# EAGLE schematic FlightComputer_PowerDistributionBoard_Rev_A (EAGLE 9.0.1)
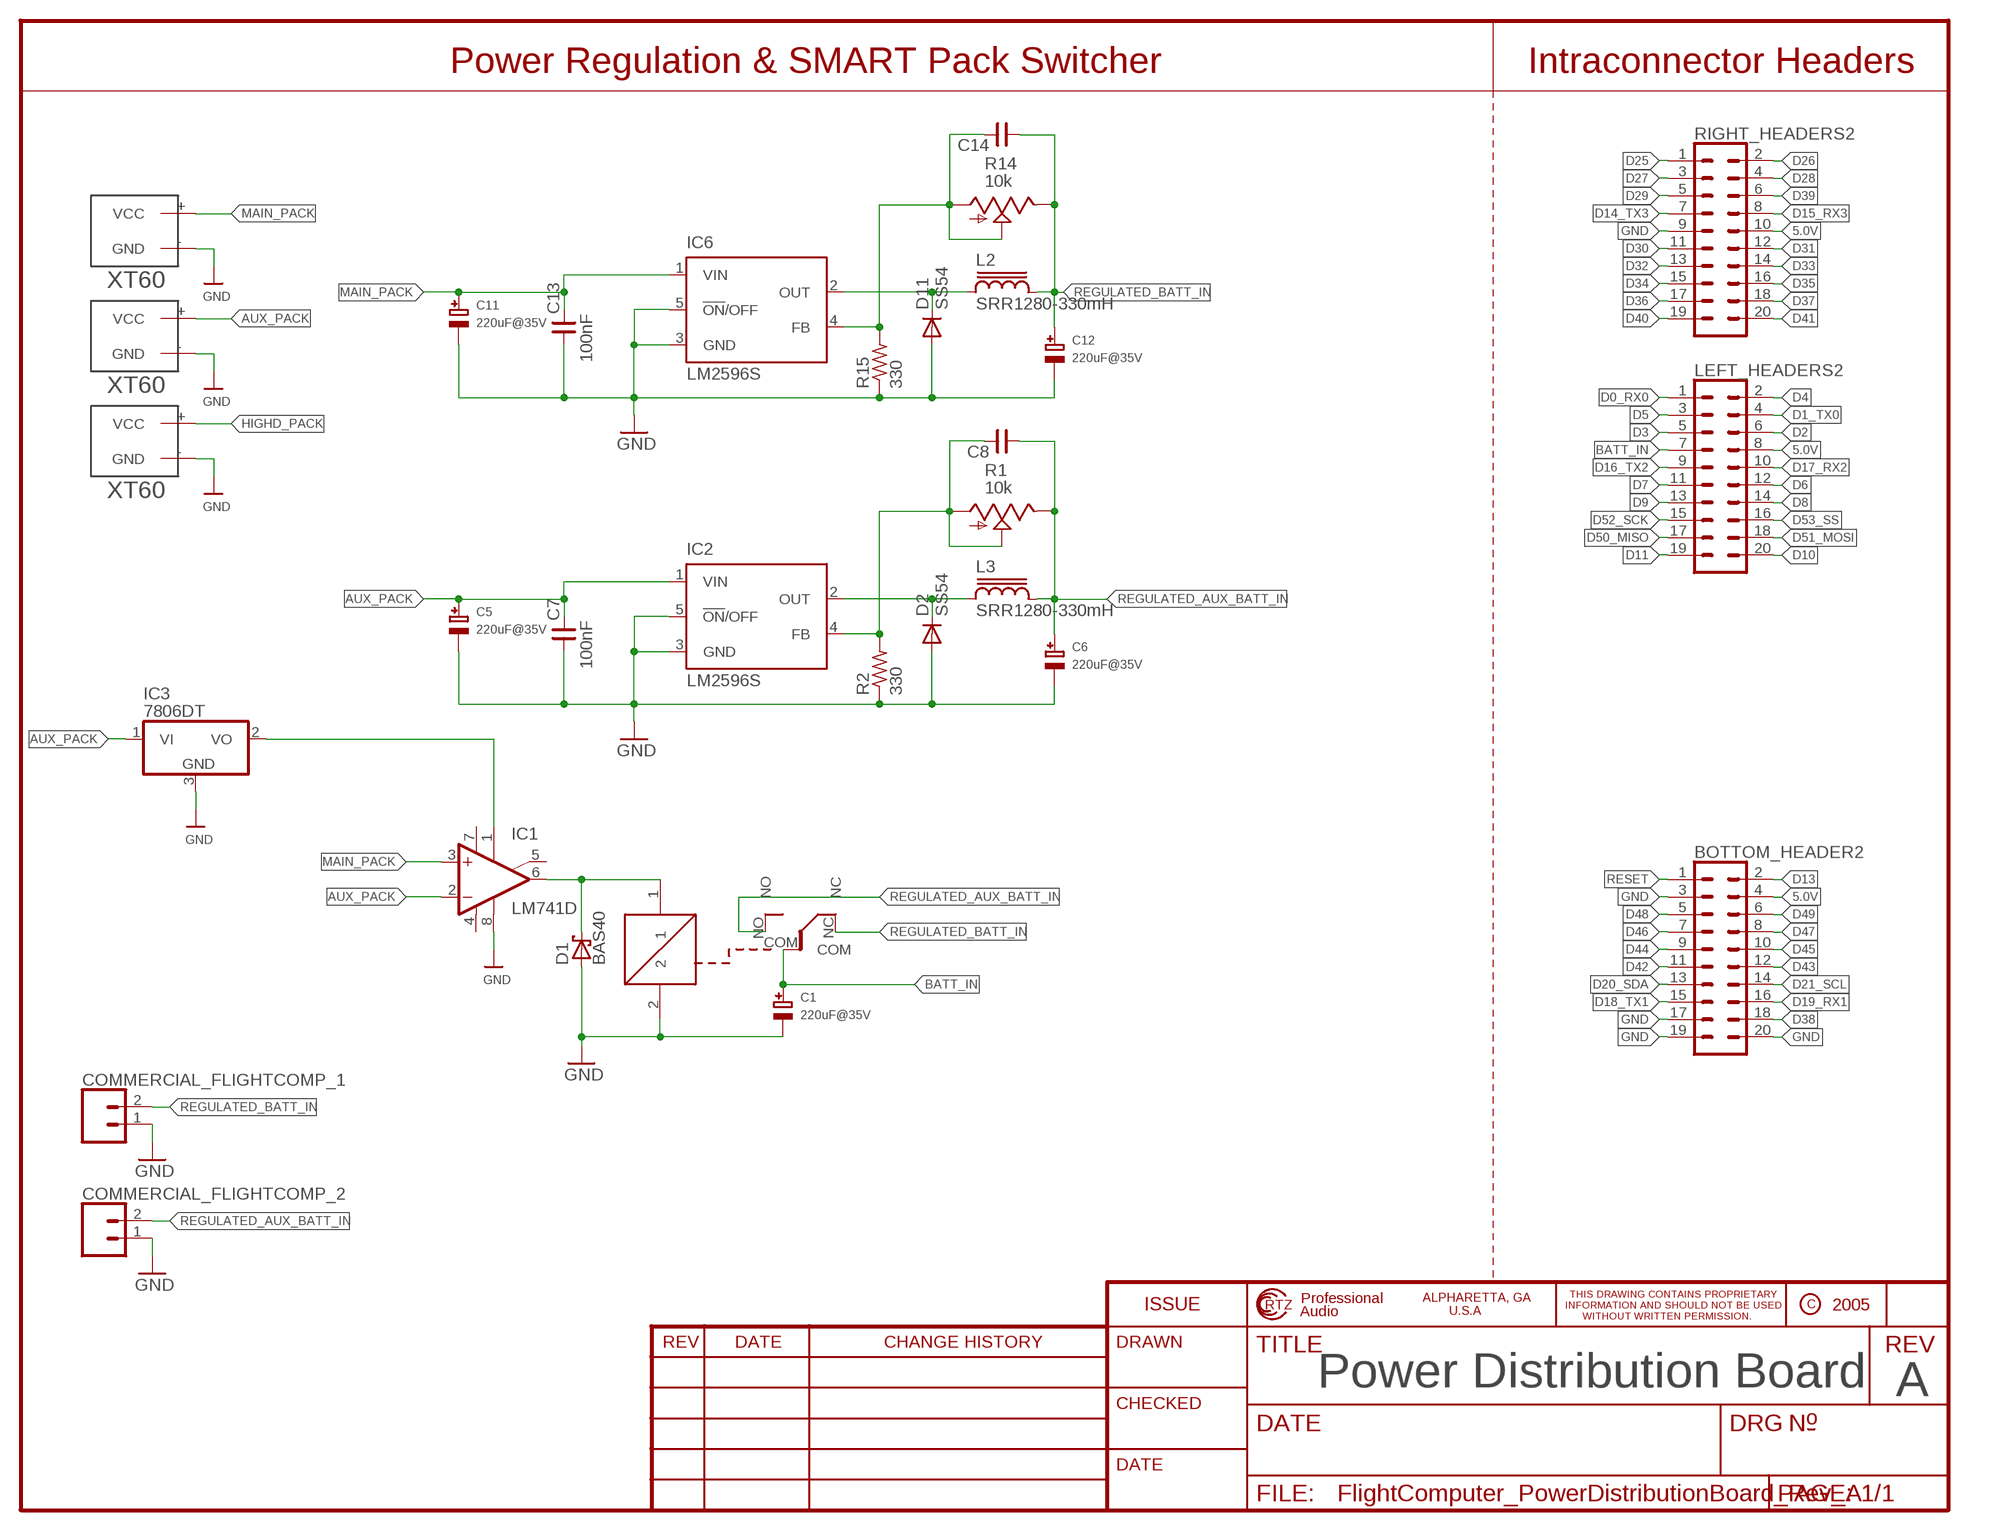
[diagram p0: schematic, sheet 1]

## Parts
BOTTOM_HEADER2  CONN_10X2  [2X10]
C1  220uF@35V  CAP_ELECTROLYTICPANASONIC_D  [PANASONIC_D]
C5  220uF@35V  CAP_ELECTROLYTICPANASONIC_D  [PANASONIC_D]
C6  220uF@35V  CAP_ELECTROLYTICPANASONIC_D  [PANASONIC_D]
C7  100nF  CNP-0603  [0603]
C8  CNP-0603  [0603]
C11  220uF@35V  CAP_ELECTROLYTICPANASONIC_D  [PANASONIC_D]
C12  220uF@35V  CAP_ELECTROLYTICPANASONIC_D  [PANASONIC_D]
C13  100nF  CNP-0603  [0603]
C14  CNP-0603  [0603]
COMMERCIAL_FLIGHTCOMP_1  CONN_02  [1X02]
COMMERCIAL_FLIGHTCOMP_2  CONN_02  [1X02]
D1  BAS40  [SOT23]
D2  SS54  S3G  [DO214AB]
D11  SS54  S3G  [DO214AB]
IC1  LM741D  [SO08]
IC2  LM2596S  [TO263-5]
IC3  7806DT  [TO252]
IC6  LM2596S  [TO263-5]
L2  SRR1280-330mH  SRR1280  [SRR1280]
L3  SRR1280-330mH  SRR1280  [SRR1280]
LEFT_HEADERS2  CONN_10X2  [2X10]
R1  10k  TRIM_US-S64W  [S64W]
R2  330  R-US_R0603  [R0603]
R14  10k  TRIM_US-S64W  [S64W]
R15  330  R-US_R0603  [R0603]
RIGHT_HEADERS2  CONN_10X2  [2X10]
U$2  XT60  [XT60]
U$3  XT60  [XT60]
U$4  XT60  [XT60]
U$14  RW-SH  [RW-SH]

## Nets
5.0V: BOTTOM_HEADER2.4 LEFT_HEADERS2.8 RIGHT_HEADERS2.10
AUX_PACK: C5.+ C7.2 IC1.2(-IN) IC2.1(VIN) IC3.1(VI) U$3.+(VCC)
BATT_IN: C1.+ LEFT_HEADERS2.7 U$14.COM
D0_RX0: LEFT_HEADERS2.1
D1_TX0: LEFT_HEADERS2.4
D2: LEFT_HEADERS2.6
D3: LEFT_HEADERS2.5
D4: LEFT_HEADERS2.2
D5: LEFT_HEADERS2.3
D6: LEFT_HEADERS2.12
D7: LEFT_HEADERS2.11
D8: LEFT_HEADERS2.14
D9: LEFT_HEADERS2.13
D10: LEFT_HEADERS2.20
D11: LEFT_HEADERS2.19
D13: BOTTOM_HEADER2.2
D14_TX3: RIGHT_HEADERS2.7
D15_RX3: RIGHT_HEADERS2.8
D16_TX2: LEFT_HEADERS2.9
D17_RX2: LEFT_HEADERS2.10
D18_TX1: BOTTOM_HEADER2.15
D19_RX1: BOTTOM_HEADER2.16
D20_SDA: BOTTOM_HEADER2.13
D21_SCL: BOTTOM_HEADER2.14
D25: RIGHT_HEADERS2.1
D26: RIGHT_HEADERS2.2
D27: RIGHT_HEADERS2.3
D28: RIGHT_HEADERS2.4
D29: RIGHT_HEADERS2.5
D30: RIGHT_HEADERS2.11
D31: RIGHT_HEADERS2.12
D32: RIGHT_HEADERS2.13
D33: RIGHT_HEADERS2.14
D34: RIGHT_HEADERS2.15
D35: RIGHT_HEADERS2.16
D36: RIGHT_HEADERS2.17
D37: RIGHT_HEADERS2.18
D38: BOTTOM_HEADER2.18
D39: RIGHT_HEADERS2.6
D40: RIGHT_HEADERS2.19
D41: RIGHT_HEADERS2.20
D42: BOTTOM_HEADER2.11
D43: BOTTOM_HEADER2.12
D44: BOTTOM_HEADER2.9
D45: BOTTOM_HEADER2.10
D46: BOTTOM_HEADER2.7
D47: BOTTOM_HEADER2.8
D48: BOTTOM_HEADER2.5
D49: BOTTOM_HEADER2.6
D50_MISO: LEFT_HEADERS2.17
D51_MOSI: LEFT_HEADERS2.18
D52_SCK: LEFT_HEADERS2.15
D53_SS: LEFT_HEADERS2.16
GND: BOTTOM_HEADER2.3 BOTTOM_HEADER2.17 BOTTOM_HEADER2.19 BOTTOM_HEADER2.20 C1.- C5.- C6.- C7.1 C11.- C12.- C13.1 COMMERCIAL_FLIGHTCOMP_1.1 COMMERCIAL_FLIGHTCOMP_2.1 D1.1(A) D2.A D11.A IC1.8(OPT) IC2.3(GND) IC2.5(!ON!/OFF) IC3.3(GND) IC6.3(GND) IC6.5(!ON!/OFF) R2.1 R15.1 RIGHT_HEADERS2.9 U$2.-(GND) U$3.-(GND) U$4.-(GND) U$14.2
HIGHD_PACK: U$4.+(VCC)
MAIN_PACK: C11.+ C13.2 IC1.3(+IN) IC6.1(VIN) U$2.+(VCC)
N$1: D2.C IC2.2(OUT) L3.1
N$2: C8.2 IC2.4(FB) R1.A R1.S R2.2
N$3: IC1.1(ON1) IC3.2(VO)
N$4: D1.3(C) IC1.6(OUT) U$14.1
N$30: D11.C IC6.2(OUT) L2.1
N$31: C14.2 IC6.4(FB) R14.A R14.S R15.2
REGULATED_AUX_BATT_IN: C6.+ C8.1 COMMERCIAL_FLIGHTCOMP_2.2 L3.2 R1.E U$14.NO
REGULATED_BATT_IN: C12.+ C14.1 COMMERCIAL_FLIGHTCOMP_1.2 L2.2 R14.E U$14.NC
RESET: BOTTOM_HEADER2.1
Unconnected: IC1.5(ON2)

## Notes on the sheet
- Power Regulation & SMART Pack Switcher | Intraconnector Headers
- Power Distribution Board | A

## Power pins joined to a net without a drawn wire
V+: IC1.7(V+)
V-: IC1.4(V-)

## Library data of the parts
BOTTOM_HEADER2 LEFT_HEADERS2 RIGHT_HEADERS2 = SparkFun-Connectors:CONN_10X2: Multi connection point. Often used as Generic Header-pin footprint for 0.1 inch spaced/style header connections On any of the 0.1 inch spaced packages, you can populate with these: Break Away Headers - Straight <https://www.sparkfun.com/products/116> (PRT-00116) Break Away Male Headers - Right Angle <https://www.sparkfun.com/products/553> (PRT-00553) Female Headers <https://www.sparkfun.com/products/115> (PRT-00115) Break Away Headers - Machine Pin <https://www.sparkfun.com/products/117> (PRT-00117) Break Away Female Headers - Swiss Machine Pin <https://www.sparkfun.com/products/743> (PRT-00743) Special note about the "SPECIAL" package: This was SPECIALLY designed to be used with our Graphic LCD Backpack. Be sure you want to use this! It is not only staggered on each line of header holes, but IT IS ALSO offset of the center point of the top and bottom lines by 5 mil. This causes the headers to lock into place on the "standard" footprint on the LCD screen. The extra squares on the tdocu layer are there simply to reference other pins (if you were to actually populate a longer header than ten long - this is what we do with the backpacks).
C1 C5 C6 C11 C12 = microbuilder:CAP_ELECTROLYTIC: Electrolytic Capacitors PANASONIC_C - Size C Panasonic Electrolytic Aluminum Capacitor 47µF 16V 20% Electrolytic Capacitor [Digikey: PCE3890TR-ND] PANASONIC_D - Size D Panasonic Electrolytic Aluminum Capacitor 100µF 25V 20% Electrolytic Capacitor [Digikey: PCE3898TR-ND]
C7 C8 C13 C14 = cap-master:CNP-: NON-POLARIZED CAP
COMMERCIAL_FLIGHTCOMP_1 COMMERCIAL_FLIGHTCOMP_2 = SparkFun-Connectors:CONN_02: Multi connection point. Often used as Generic Header-pin footprint for 0.1 inch spaced/style header connections On any of the 0.1 inch spaced packages, you can populate with these: Break Away Headers - Straight <https://www.sparkfun.com/products/116> (PRT-00116) Break Away Male Headers - Right Angle <https://www.sparkfun.com/products/553> (PRT-00553) Female Headers <https://www.sparkfun.com/products/115> (PRT-00115) Break Away Headers - Machine Pin <https://www.sparkfun.com/products/117> (PRT-00117) Break Away Female Headers - Swiss Machine Pin <https://www.sparkfun.com/products/743> (PRT-00743) For SCREWTERMINALS and SPRING TERMINALS visit here: Screw Terimnals on SparkFun.com <https://www.sparkfun.com/search/results?term=Screw+Terminals> (5mm/3.5mm/2.54mm spacing) This device is also useful as a general connection point to wire up your design to another part of your project. Our various solder wires solder well into these plated through hole pads. Hook-Up Wire - Assortment (Stranded, 22 AWG) <https://www.sparkfun.com/products/11375> (PRT-11375) Hook-Up Wire - Assortment (Solid Core, 22 AWG) <https://www.sparkfun.com/products/11367> (PRT-11367) View the entire wire category on our website here <https://www.sparkfun.com/categories/141> Special notes: Molex polarized connector foot print use with: PRT-08233 with associated crimp pins and housings. 2.54_SCREWTERM for use with PRT-10571. 3.5mm Screw Terminal footprints for PRT-08084 5mm Screw Terminal footprints for use with PRT-08432
D1 = diode:BAS40: Silicon Schottky Diodes General-purpose diode for high-speed switching
D2 D11 = s3x_10:S3*: S3A - S3N General Purpose Rectifiers Source: http://www.fairchildsemi.com/datasheets/S3/S3A.pdf; MF: Fairchild; MPN: S3G; OC_FARNELL: 2454094; OC_NEWARK: 58K2397
IC1 = linear:*741: OP AMP
IC2 IC6 = national-semiconductor:LM2596: SIMPLE SWITCHER® Power Converter 150 kHz 3A Step-Down Voltage Regulator Source: http://www.national.com/ds/LM/LM2596.pdf; MF: NATIONAL SEMICONDUCTOR; MPN: LM2596S-ADJ/NOPB; OC_FARNELL: 9494367; OC_NEWARK: 41K3842
IC3 = adafruit:78*: Positive VOLTAGE REGULATOR Added bigger pads to the TO-92 package
L2 L3 = inductor-bourns:SRR1280: POWER INDUCTOR
R1 R14 = pot:TRIM_US-: POTENTIOMETER
R2 R15 = adafruit:R-US_: RESISTOR, American symbol
U$2-U$4 = XT60:XT60: XT60
U$14 = goodsky1:RW-SH

## Net classes
0 default: width 0.203 mm, drill 0.254 mm, clearance 0.127 mm
1 16mil: width 0.254 mm, drill 0.254 mm, clearance 0.127 mm
3 32mil: width 0.254 mm, drill 0.254 mm, clearance 0.127 mm